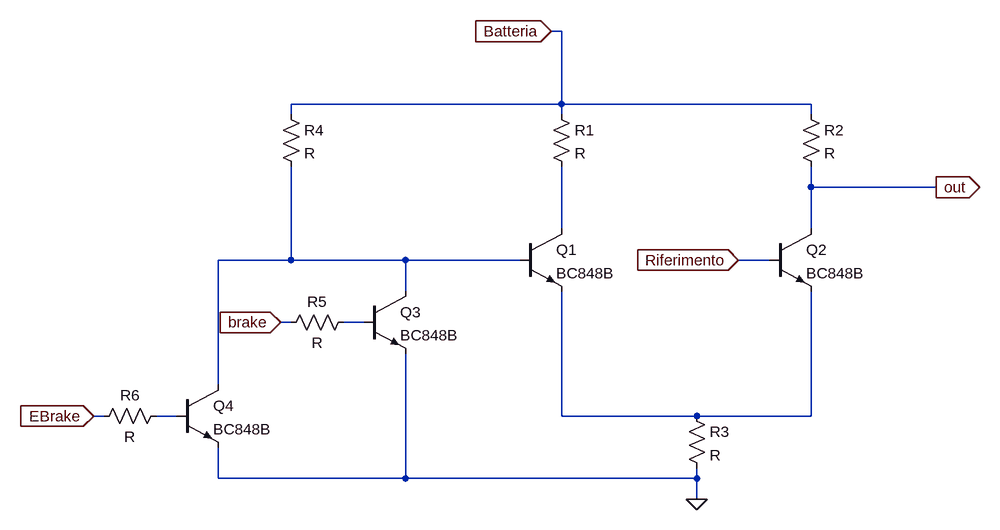
[diagram p0: schematic frenobjt.asc]
frenobjt.asc, the LTspice schematic file:
Version 4.1
SHEET 1 880 680
WIRE 192 -224 176 -224
WIRE 192 -112 192 -224
WIRE 192 -112 -224 -112
WIRE 576 -112 192 -112
WIRE -224 -96 -224 -112
WIRE 192 -96 192 -112
WIRE 576 -96 576 -112
WIRE 576 16 576 -16
WIRE 768 16 576 16
WIRE 192 80 192 -16
WIRE 576 80 576 16
WIRE -224 128 -224 -16
WIRE -224 128 -336 128
WIRE -48 128 -224 128
WIRE 128 128 -48 128
WIRE 512 128 464 128
WIRE -48 176 -48 128
WIRE -224 224 -240 224
WIRE -112 224 -144 224
WIRE -336 320 -336 128
WIRE -512 368 -528 368
WIRE -400 368 -432 368
WIRE 192 368 192 176
WIRE 400 368 192 368
WIRE 576 368 576 176
WIRE 576 368 400 368
WIRE -336 464 -336 416
WIRE -48 464 -48 272
WIRE -48 464 -336 464
WIRE 400 464 400 448
WIRE 400 464 -48 464
WIRE 400 496 400 464
FLAG 400 496 0
FLAG 768 16 out
IOPIN 768 16 Out
FLAG -240 224 brake
IOPIN -240 224 In
FLAG -528 368 EBrake
IOPIN -528 368 In
FLAG 176 -224 Batteria
IOPIN 176 -224 In
FLAG 464 128 Riferimento
IOPIN 464 128 In
SYMBOL res 560 -112 R0
SYMATTR InstName R2
SYMBOL res 384 352 R0
SYMATTR InstName R3
SYMBOL res 176 -112 R0
SYMATTR InstName R1
SYMBOL npn 512 80 R0
SYMATTR InstName Q2
SYMATTR Value BC848B
SYMBOL npn 128 80 R0
SYMATTR InstName Q1
SYMATTR Value BC848B
SYMBOL res -240 -112 R0
SYMATTR InstName R4
SYMBOL npn -112 176 R0
SYMATTR InstName Q3
SYMATTR Value BC848B
SYMBOL npn -400 320 R0
SYMATTR InstName Q4
SYMATTR Value BC848B
SYMBOL res -128 208 R90
WINDOW 0 0 56 VBottom 2
WINDOW 3 32 56 VTop 2
SYMATTR InstName R5
SYMBOL res -416 352 R90
WINDOW 0 0 56 VBottom 2
WINDOW 3 32 56 VTop 2
SYMATTR InstName R6

The netlist it stands for:
* frenobjt.asc
R2 Batteria out R
R3 N005 0 R
R1 Batteria N001 R
Q2 out Riferimento N005 0 BC848B
Q1 N001 N002 N005 0 BC848B
R4 Batteria N002 R
Q3 N002 N003 0 0 BC848B
Q4 N002 N004 0 0 BC848B
R5 N003 brake R
R6 N004 EBrake R
.model NPN NPN
.model PNP PNP
.lib standard.bjt
.backanno
.end